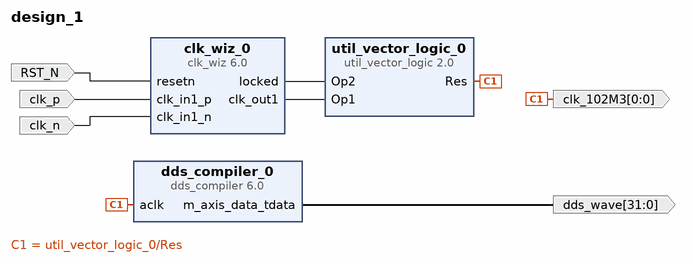
[diagram p0: block diagram of the top level]
# Vivado block design design_1, xc7a100tfgg484-2, Vivado 2018.3
create_bd_design design_1

create_bd_port -dir I -type rst RST_N
create_bd_port -dir O -from 0 -to 0 -type clk clk_102M3
set_property -dict {CONFIG.FREQ_HZ 51150000} [get_bd_ports clk_102M3]
create_bd_port -dir O -from 31 -to 0 -type data dds_wave
create_bd_port -dir I -type clk clk_n
set_property -dict {CONFIG.FREQ_HZ 200000000} [get_bd_ports clk_n]
create_bd_port -dir I clk_p

create_bd_cell -type ip -vlnv xilinx.com:ip:clk_wiz:6.0 clk_wiz_0
set_property -dict [list \
  CONFIG.CLKIN1_JITTER_PS 50.0 \
  CONFIG.CLKOUT1_JITTER 508.263 \
  CONFIG.CLKOUT1_PHASE_ERROR 688.787 \
  CONFIG.CLKOUT1_REQUESTED_OUT_FREQ 51.15 \
  CONFIG.MMCM_CLKFBOUT_MULT_F 62.500 \
  CONFIG.MMCM_CLKIN1_PERIOD 5.000 \
  CONFIG.MMCM_CLKIN2_PERIOD 10.0 \
  CONFIG.MMCM_CLKOUT0_DIVIDE_F 14.375 \
  CONFIG.MMCM_DIVCLK_DIVIDE 17 \
  CONFIG.PRIM_IN_FREQ 200 \
  CONFIG.PRIM_SOURCE Differential_clock_capable_pin \
  CONFIG.RESET_PORT resetn \
  CONFIG.RESET_TYPE ACTIVE_LOW \
] [get_bd_cells clk_wiz_0]
create_bd_cell -type ip -vlnv xilinx.com:ip:dds_compiler:6.0 dds_compiler_0
set_property -dict [list \
  CONFIG.Channels 1 \
  CONFIG.DATA_Has_TLAST Not_Required \
  CONFIG.DDS_Clock_Rate 51.15 \
  CONFIG.Frequency_Resolution 1560.9741211 \
  CONFIG.Latency 9 \
  CONFIG.M_DATA_Has_TUSER Not_Required \
  CONFIG.M_PHASE_Has_TUSER Not_Required \
  CONFIG.Noise_Shaping Auto \
  CONFIG.Output_Frequency1 10.23 \
  CONFIG.Output_Width 16 \
  CONFIG.PINC1 1100110011001 \
  CONFIG.Parameter_Entry System_Parameters \
  CONFIG.Phase_Width 15 \
  CONFIG.Phase_offset Fixed \
  CONFIG.S_PHASE_Has_TUSER Not_Required \
  CONFIG.Spurious_Free_Dynamic_Range 96 \
] [get_bd_cells dds_compiler_0]
create_bd_cell -type ip -vlnv xilinx.com:ip:util_vector_logic:2.0 util_vector_logic_0
set_property -dict {CONFIG.C_SIZE 1} [get_bd_cells util_vector_logic_0]

# ---- connections ----

connect_bd_net [get_bd_pins clk_wiz_0/locked] [get_bd_pins util_vector_logic_0/Op2]
connect_bd_net [get_bd_pins clk_wiz_0/clk_out1] [get_bd_pins util_vector_logic_0/Op1]
connect_bd_net [get_bd_pins util_vector_logic_0/Res] [get_bd_ports clk_102M3] [get_bd_pins dds_compiler_0/aclk]
connect_bd_net [get_bd_ports RST_N] [get_bd_pins clk_wiz_0/resetn]
connect_bd_net [get_bd_pins dds_compiler_0/m_axis_data_tdata] [get_bd_ports dds_wave]
connect_bd_net [get_bd_ports clk_p] [get_bd_pins clk_wiz_0/clk_in1_p]
connect_bd_net [get_bd_ports clk_n] [get_bd_pins clk_wiz_0/clk_in1_n]

validate_bd_design
save_bd_design
